# Altium schematic sheet 06debug.SchDoc
size A3
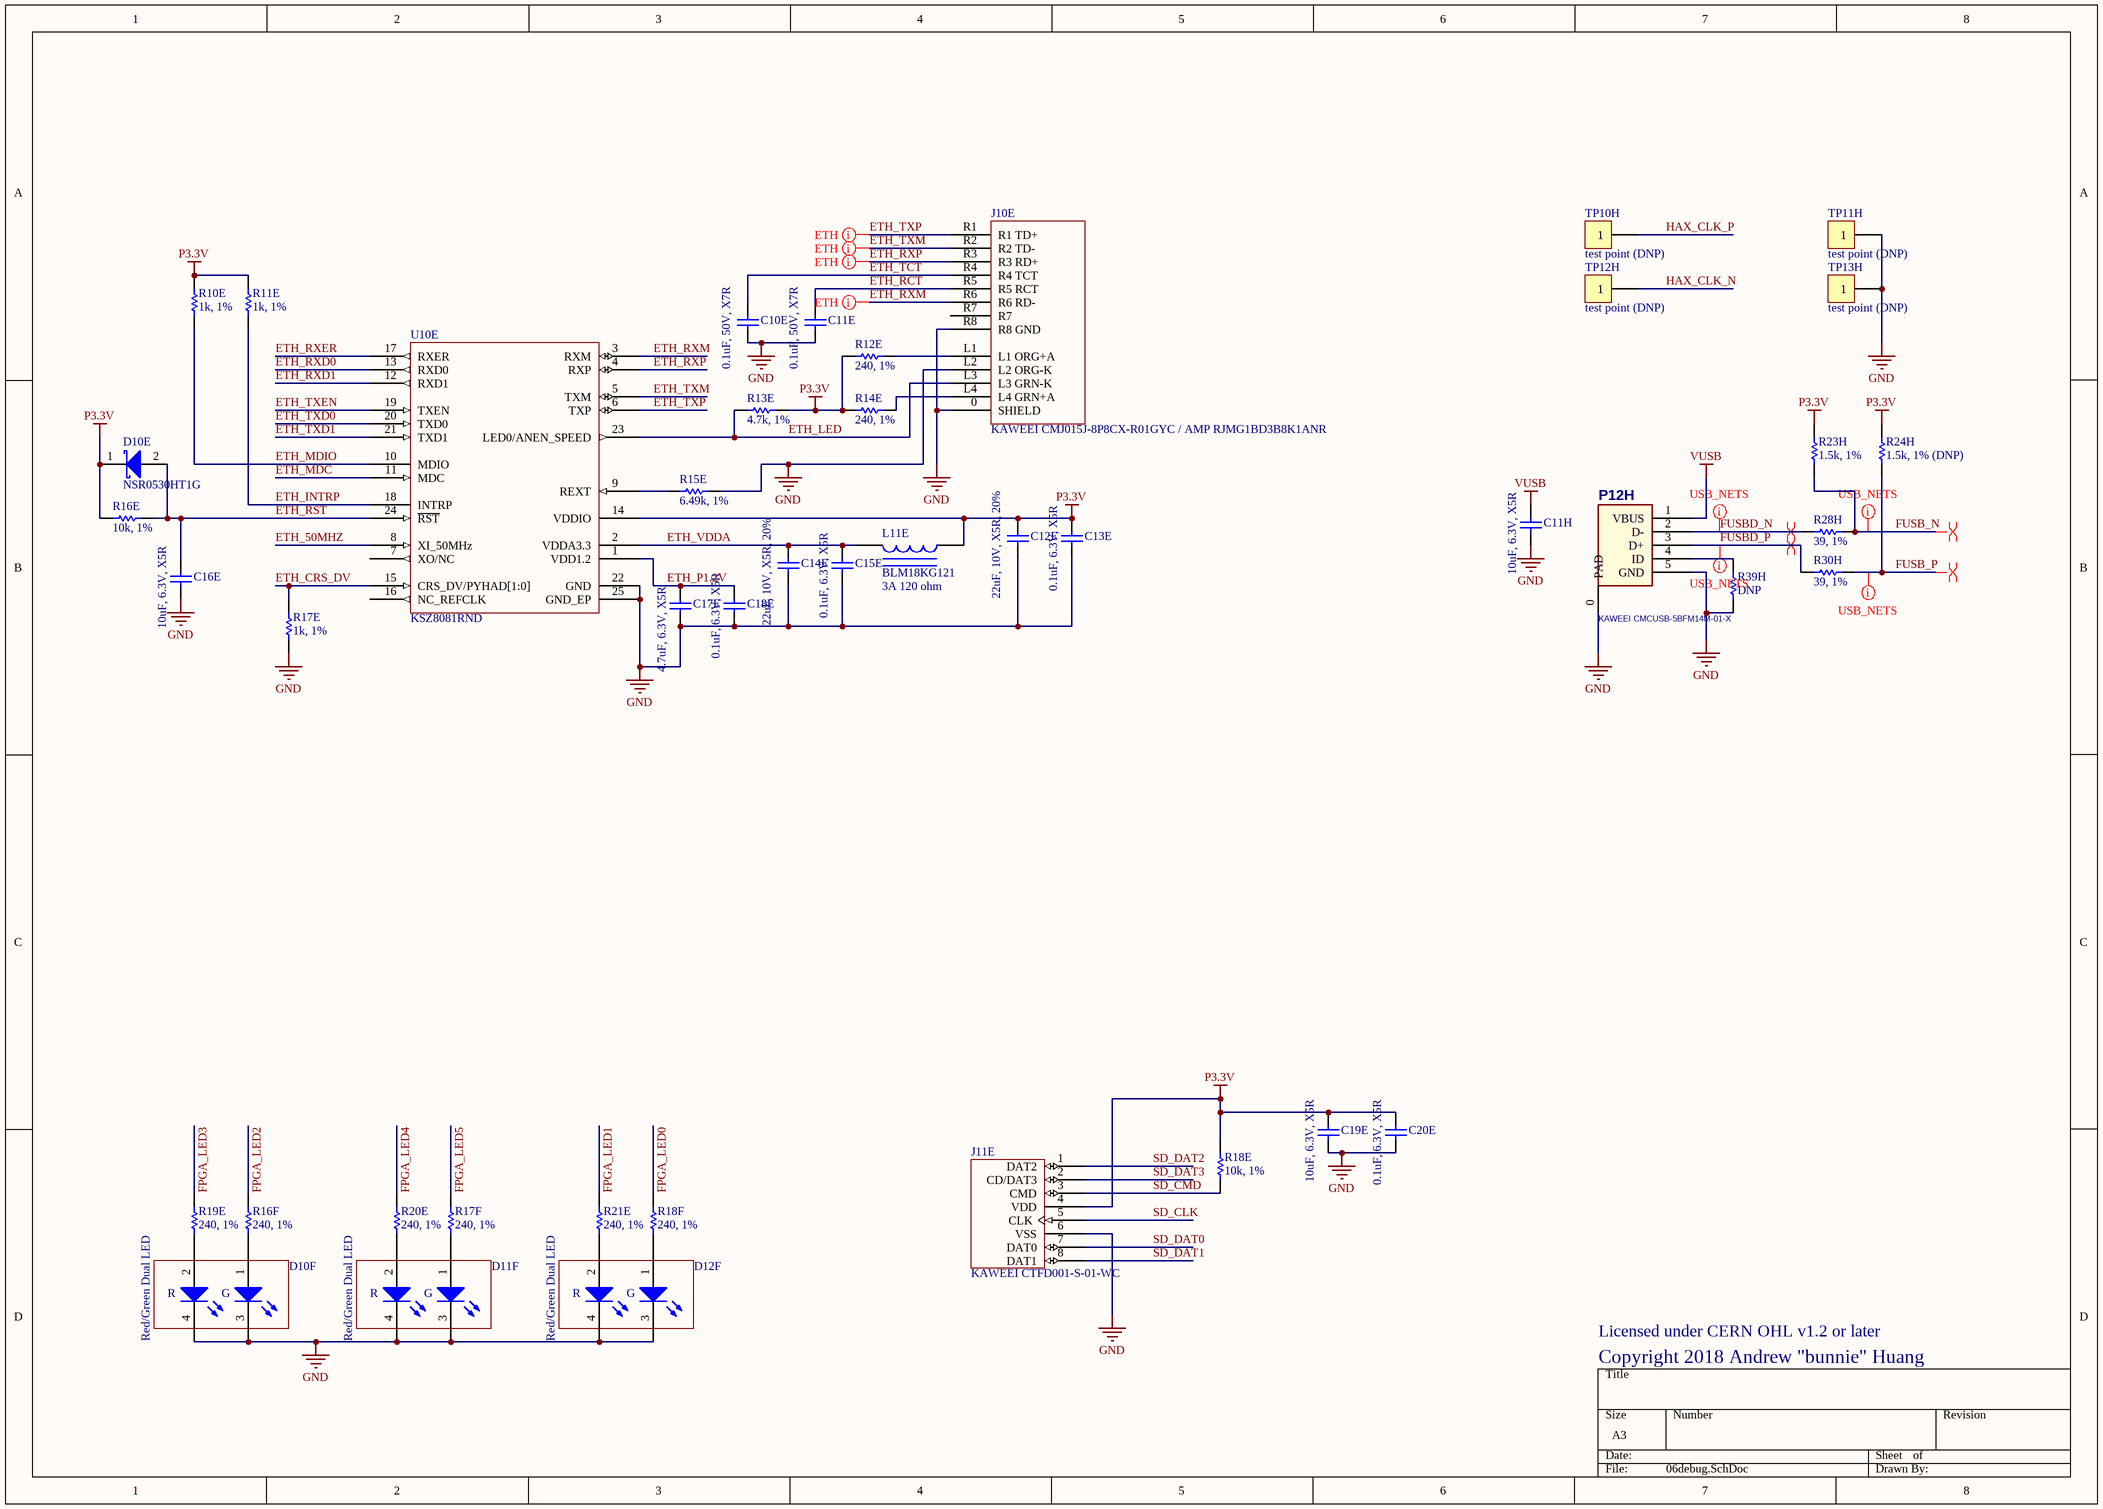
[diagram p0: 06debug.SchDoc]

## Parts
C10E  0.1uF, 50V, X7R  [CAPC2012N]
C11E  0.1uF, 50V, X7R  [CAPC2012N]
C11H  10uF, 6.3V, X5R  [CAPC1608N]
C12E  22uF, 10V, X5R, 20%  [CAPC2012N]
C13E  0.1uF, 6.3V, X5R  [CAPC0603X03L]
C14E  22uF, 10V, X5R, 20%  [CAPC2012N]
C15E  0.1uF, 6.3V, X5R  [CAPC0603X03L]
C16E  10uF, 6.3V, X5R  [CAPC1608N]
C17E  4.7uF, 6.3V, X5R  [CAPC1005N]
C18E  0.1uF, 6.3V, X5R  [CAPC0603X03L]
C19E  10uF, 6.3V, X5R  [CAPC1608N]
C20E  0.1uF, 6.3V, X5R  [CAPC0603X03L]
D10E  NSR0530HT1G  [SOD-323]
D10F  Red/Green Dual LED  [LED_1210_DUAL]
D11F  Red/Green Dual LED  [LED_1210_DUAL]
D12F  Red/Green Dual LED  [LED_1210_DUAL]
J10E  KAWEEI CMJ015J-8P8CX-R01GYC / AMP RJMG1BD3B8K1ANR  [UDE_RB1-125BAG1A]
J11E  KAWEEI CTFD001-S-01-WC  [AUK_TFC08W01-HC-H]
L11E  BLM18KG121  value 3A 120 ohm  [INDC1608AN]
P12H  KAWEEI CMCUSB-5BFM14M-01-X  [USB_MICRO_B_SMT - KAWEEI]
R10E  1k, 1%  [RESC1005N]
R11E  1k, 1%  [RESC1005N]
R12E  240, 1%  [CAPC0603X03L]
R13E  4.7k, 1%  [RESC1005N]
R14E  240, 1%  [CAPC0603X03L]
R15E  6.49k, 1%  [RESC1005N]
R16E  10k, 1%  [RESC1005N]
R16F  240, 1%  [CAPC0603X03L]
R17E  1k, 1%  [RESC1005N]
R17F  240, 1%  [CAPC0603X03L]
R18E  10k, 1%  [RESC1005N]
R18F  240, 1%  [CAPC0603X03L]
R19E  240, 1%  [CAPC0603X03L]
R20E  240, 1%  [CAPC0603X03L]
R21E  240, 1%  [CAPC0603X03L]
R23H  1.5k, 1%  [RESC1005N]
R24H  1.5k, 1% (DNP)  [RESC1005N]
R28H  39, 1%  [RESC1005N]
R30H  39, 1%  [RESC1005N]
R39H  DNP  [RESC1005N]
TP10H  test point (DNP)  [TP_2MM_SQ]
TP11H  test point (DNP)  [TP_2MM_SQ]
TP12H  test point (DNP)  [TP_2MM_SQ]
TP13H  test point (DNP)  [TP_2MM_SQ]
U10E  KSZ8081RND  [QFN50P400X400-24VBN]

## Nets
GND: C10E.2 C11E.2 C11H.2 C12E.2 C13E.2 C14E.2 C15E.2 C16E.2 C17E.2 C18E.2 C19E.2 C20E.2 D10F.3(K) D10F.4(K) D11F.3(K) D11F.4(K) D12F.3(K) D12F.4(K) J10E.0(SHIELD) J10E.L2(L2_ORG-K) J10E.R8(R8_GND) J11E.6(VSS) P12H.0(PAD) P12H.5(GND) R15E.1 R17E.1 R39H.2 TP11H.1 TP13H.1 U10E.22(GND) U10E.25(GND_EP)
P3.3V: C12E.1 C13E.1 C19E.1 C20E.1 D10E.1(K) J11E.4(VDD) L11E.1 R10E.2 R11E.2 R12E.2 R13E.1 R14E.2 R16E.1 R18E.1 R23H.1 R24H.1 U10E.14(VDDIO)
VUSB: C11H.1 P12H.1(VBUS)
ETH_50MHZ: U10E.8(XI_50MHz)
ETH_CRS_DV: R17E.2 U10E.15(CRS_DV/PYHAD[1:0])
ETH_INTRP: R11E.1 U10E.18(INTRP)
ETH_LED: J10E.L3(L3_GRN-K) R13E.2 U10E.23(LED0/ANEN_SPEED)
ETH_MDC: U10E.11(MDC)
ETH_MDIO: R10E.1 U10E.10(MDIO)
ETH_P1.2V: C17E.1 C18E.1 U10E.1(VDD1.2)
ETH_RCT: C11E.1 J10E.R5(R5_RCT)
ETH_RST: C16E.1 D10E.2(A) R16E.2 U10E.24(~{RST})
ETH_RXD0: U10E.13(RXD0)
ETH_RXD1: U10E.12(RXD1)
ETH_RXER: U10E.17(RXER)
ETH_RXM: J10E.R6(R6_RD-) U10E.3(RXM)
ETH_RXP: J10E.R3(R3_RD+) U10E.4(RXP)
ETH_TCT: C10E.1 J10E.R4(R4_TCT)
ETH_TXD0: U10E.20(TXD0)
ETH_TXD1: U10E.21(TXD1)
ETH_TXEN: U10E.19(TXEN)
ETH_TXM: J10E.R2(R2_TD-) U10E.5(TXM)
ETH_TXP: J10E.R1(R1_TD+) U10E.6(TXP)
ETH_VDDA: C14E.1 C15E.1 L11E.2 U10E.2(VDDA3.3)
FPGA_LED0: R18F.2
FPGA_LED1: R21E.2
FPGA_LED2: R16F.2
FPGA_LED3: R19E.2
FPGA_LED4: R20E.2
FPGA_LED5: R17F.2
FUSB_N: R23H.2 R28H.1
FUSB_P: R24H.2 R30H.1
FUSBD_N: P12H.2(D-) R28H.2
FUSBD_P: P12H.3(D+) R30H.2
HAX_CLK_N: TP12H.1
HAX_CLK_P: TP10H.1
SD_CLK: J11E.5(CLK)
SD_CMD: J11E.3(CMD) R18E.2
SD_DAT0: J11E.7(DAT0)
SD_DAT1: J11E.8(DAT1)
SD_DAT2: J11E.1(DAT2)
SD_DAT3: J11E.2(CD/DAT3)
NetD10F_1: D10F.1(A) R16F.1
NetD10F_2: D10F.2(A) R19E.1
NetD11F_1: D11F.1(A) R17F.1
NetD11F_2: D11F.2(A) R20E.1
NetD12F_1: D12F.1(A) R18F.1
NetD12F_2: D12F.2(A) R21E.1
NetJ10E_L1: J10E.L1(L1_ORG+A) R12E.1
NetJ10E_L4: J10E.L4(L4_GRN+A) R14E.1
NetP12H_4: P12H.4(ID) R39H.1
NetR15E_2: R15E.2 U10E.9(REXT)

Not connected (* = marked no-connect by the designer): J10E R7; U10E 7(XO/NC) 16(NC_REFCLK)

## Layout directives
differential pair: FUSB_N, FUSB_P, FUSBD_N, FUSBD_P
net class USB_NETS: FUSB_N, FUSB_P, FUSBD_N, FUSBD_P
net class ETH: ETH_RXM, ETH_RXP, ETH_TXM, ETH_TXP

## Notes on the sheet
- Licensed under CERN OHL v1.2 or later
- Copyright 2018 Andrew "bunnie" Huang
- (in symbol DUAL_LED_1210) R; G

## Library data of the parts
C10E C11E = Cap Semi: Capacitor (Semiconductor SIM Model); MPN: CL21B104KBCNNWC; VENDOR: Samsung; MYPN: C-104-50-X7R-0805
C11H C16E C19E = Cap Semi: Capacitor (Semiconductor SIM Model); MPN: CL10A106MQ8NNNC; VENDOR: Samsung; MYPN: C-106-6.3-X5R-0603
C12E C14E = Cap Semi: Capacitor (Semiconductor SIM Model); MPN: GRM21BR61A226ME51L; MFG: Murata; MYPN: C-226-10-X5R-0805; Published: 8-Jun-2000; LatestRevisionDate: 17-Jul-2002; LatestRevisionNote: Re-released for DXP Platform.; PackageReference: C1206; Publisher: Altium Limited
C13E C15E C18E C20E = Cap Semi: Capacitor (Semiconductor SIM Model); MPN: CL03A104KQ3NNNC; VENDOR: Samsung; MYPN: C-104-6p3-X5R-0201
C17E = Cap Semi: Capacitor (Semiconductor SIM Model); MPN: CL05A475MQ5NQNC; VENDOR: Samsung; MYPN: C-475-6p3-X5R-0402
D10E = D Schottky: Schottky Diode; MPN: NSR0530H-D; VENDOR: Semtech HK LTD; MYPN: D-S-0p5-30-0p37-SOD323; Revision: July-2002: Re-released for DXP Platform.
D10F D11F D12F = DUAL_LED_1210: 3.2mm x 2.7mm dual LED red/green; MPN: CB-3227QRQGC-PX; MYPN: D-LED-1210-DUAL-RED-GREEN; VENDOR: Citybright
J10E = UDE RB1-ZZ-0025: 10/100 Ethernet Jack with Magnetics; MPN: CMJ015J-8P8CX-R01GYC / RJMG1BD3B8K1ANR; VENDOR: Kaweei / Amphenol; MYPN: J-RB1-ZZ-0025
J11E = MICRO_SD: Captive Micro-SD card for firmware images; MYPN: J-MICROSD-SLIDELOCK; VENDOR: KAWEEI; MPN: CTFD001-S-01-WC
L11E = Inductor Iron: Magnetic-Core Inductor; MPN: BLM18KG121TN1D; VENDOR: MURATA; MYPN: L-FB-120-3A; Published: 24-Mar-1999; LatestRevisionDate: 17-Jul-2002; LatestRevisionNote: Re-released for DXP Platform.; PackageReference: AXIAL-0.9; Publisher: Altium Limited
P12H = USB_MINI-AB_1: Micro USB B type connector; MYPN: J-MICROUSB-SMT-FCI; MPN: CMCUSB-5BFM14M-01-X; VENDOR: KAWEEI
R10E R11E R17E = Res1: Resistor; MPN: RS02U102FT; VENDOR: Fenghua; MYPN: R-102-1P-1_16W-0402
R12E R14E R16F R17F R18F R19E R20E R21E = Res1: Resistor; VENDOR: ANY; MYPN: R-241-1P-1_16W-0201; MPN: ANY
R13E = Res1: Resistor; VENDOR: ANY; MYPN: R-472-1P-1_16W-0402; MPN: ANY
R15E = Res1: Resistor; VENDOR: ANY; MYPN: R-6491-1P-1_16W-0402; MPN: ANY
R16E R18E = Res1: Resistor; MPN: RS02U103FT; VENDOR: Fenghua; MYPN: R-103-1P-1_16W-0402
R23H = Res1: Resistor; MPN: RS02U152FT; VENDOR: Fenghua; MYPN: R-152-1P-1_16W-0402
R24H = Res1: Resistor; VENDOR: Fenghua; MYPN: DNP; MPN: DNP
R28H R30H = Res1: Resistor; VENDOR: ANY; MYPN: R-390-1P-1_16W-0402; MPN: ANY
R39H = Res1: Resistor; VENDOR: ANY; MYPN: DNP; MPN: ANY
TP10H TP11H TP12H TP13H = CON1: Connector
U10E = KSZ8081RND: KSZ8081RND MII Ethernet PHY; MPN: KSZ8081RNDCA; MYPN: UKSZ8081RND; VENDOR: Microchip